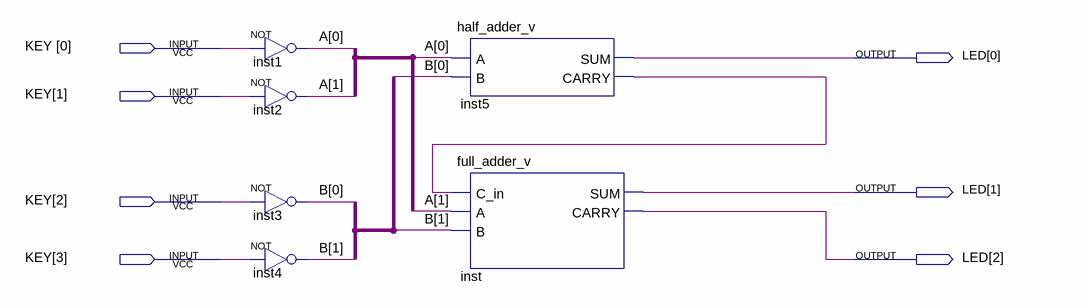
[diagram p0: schematic sheet]
// Quartus schematic week_03.bdf as structural Verilog: 6 symbols, 7 pins
module week_03 (
  input  [3:0] KEY,
  output [2:0] LED
);

  wire inst5_carry;
  wire [1:0] A, B;

  not inst1 (A[0], KEY[0]);
  not inst2 (A[1], KEY[1]);
  not inst3 (B[0], KEY[2]);
  not inst4 (B[1], KEY[3]);
  half_adder_v inst5 (.A(A[0]), .B(B[0]), .SUM(LED[0]), .CARRY(inst5_carry));
  full_adder_v inst (.C_in(inst5_carry), .A(A[1]), .B(B[1]), .SUM(LED[1]), .CARRY(LED[2]));
endmodule
